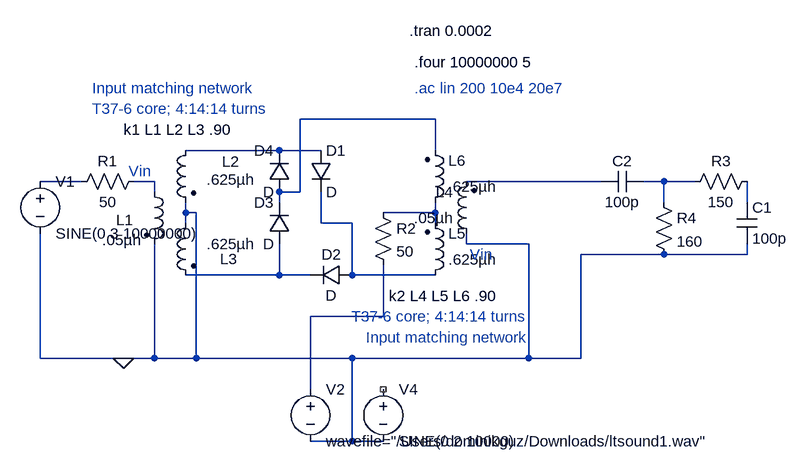
[diagram p0: schematic BalancedMixer.asc]
BalancedMixer.asc, the LTspice schematic file:
Version 4
SHEET 1 1704 764
WIRE 1056 144 848 144
WIRE 816 192 672 192
WIRE 880 192 816 192
WIRE 1056 192 1056 144
WIRE 512 240 448 240
WIRE 624 240 592 240
WIRE 1312 240 1104 240
WIRE 1408 240 1376 240
WIRE 1456 240 1408 240
WIRE 624 256 624 240
WIRE 848 256 848 144
WIRE 848 256 816 256
WIRE 816 272 816 256
WIRE 1408 272 1408 240
WIRE 1536 272 1536 240
WIRE 672 288 672 272
WIRE 688 288 672 288
WIRE 1056 288 1056 272
WIRE 1056 288 976 288
WIRE 672 304 672 288
WIRE 880 304 880 256
WIRE 928 304 880 304
WIRE 1056 304 1056 288
WIRE 1104 336 1104 320
WIRE 1200 336 1104 336
WIRE 1408 352 1280 352
WIRE 1536 352 1536 336
WIRE 1536 352 1408 352
WIRE 816 384 816 336
WIRE 816 384 672 384
WIRE 864 384 816 384
WIRE 928 384 928 304
WIRE 1056 384 928 384
WIRE 976 448 976 368
WIRE 976 448 864 448
WIRE 448 512 448 320
WIRE 576 512 448 512
WIRE 624 512 624 336
WIRE 624 512 576 512
WIRE 688 512 688 288
WIRE 688 512 624 512
WIRE 928 512 688 512
WIRE 1200 512 1200 336
WIRE 1200 512 928 512
WIRE 1280 512 1280 352
WIRE 1280 512 1200 512
WIRE 864 560 864 448
WIRE 928 640 928 512
WIRE 928 640 864 640
WIRE 976 640 928 640
FLAG 576 512 0
SYMBOL ind2 608 240 R0
WINDOW 0 -43 59 Left 2
WINDOW 3 -65 90 Left 2
SYMATTR InstName L1
SYMATTR Value .05µh
SYMATTR Type ind
SYMBOL ind2 688 176 M0
WINDOW 0 -67 33 Left 2
WINDOW 3 -90 61 Left 2
SYMATTR InstName L2
SYMATTR Value .625µh
SYMATTR Type ind
SYMBOL ind2 688 288 M0
WINDOW 0 -64 71 Left 2
WINDOW 3 -90 48 Left 2
SYMATTR InstName L3
SYMATTR Value .625µh
SYMATTR Type ind
SYMBOL ind2 1120 336 R180
WINDOW 0 36 80 Left 2
WINDOW 3 36 40 Left 2
SYMATTR InstName L4
SYMATTR Value .05µh
SYMATTR Type ind
SYMBOL ind2 1040 400 M180
WINDOW 0 36 80 Left 2
WINDOW 3 36 40 Left 2
SYMATTR InstName L5
SYMATTR Value .625µh
SYMATTR Type ind
SYMBOL ind2 1040 288 M180
WINDOW 0 36 80 Left 2
WINDOW 3 36 40 Left 2
SYMATTR InstName L6
SYMATTR Value .625µh
SYMATTR Type ind
SYMBOL diode 864 192 R0
SYMATTR InstName D1
SYMBOL diode 928 368 R90
WINDOW 0 0 32 VBottom 2
WINDOW 3 32 32 VTop 2
SYMATTR InstName D2
SYMBOL diode 832 336 R180
WINDOW 0 24 64 Left 2
WINDOW 3 24 0 Left 2
SYMATTR InstName D3
SYMBOL diode 832 256 R180
WINDOW 0 24 64 Left 2
WINDOW 3 24 0 Left 2
SYMATTR InstName D4
SYMBOL voltage 448 224 R0
SYMATTR InstName V1
SYMATTR Value SINE(0 3 10000000)
SYMBOL voltage 976 544 R0
SYMATTR InstName V4
SYMATTR Value SINE(0 2 10000)
SYMBOL res 608 224 R90
WINDOW 0 0 56 VBottom 2
WINDOW 3 32 56 VTop 2
SYMATTR InstName R1
SYMATTR Value 50
SYMBOL res 960 272 R0
SYMATTR InstName R2
SYMATTR Value 50
SYMBOL voltage 864 544 R0
SYMATTR InstName V2
SYMATTR Value wavefile="/Users/dominikguz/Downloads/ltsound1.wav"
SYMBOL res 1552 224 R90
WINDOW 0 0 56 VBottom 2
WINDOW 3 32 56 VTop 2
SYMATTR InstName R3
SYMATTR Value 150
SYMBOL cap 1520 272 R0
SYMATTR InstName C1
SYMATTR Value 100p
SYMBOL cap 1376 224 R90
WINDOW 0 0 32 VBottom 2
WINDOW 3 32 32 VTop 2
SYMATTR InstName C2
SYMATTR Value 100p
SYMBOL res 1392 256 R0
SYMATTR InstName R4
SYMATTR Value 160
TEXT 576 160 Left 2 !k1 L1 L2 L3 .90
TEXT 528 96 Left 2 ;Input matching network
TEXT 584 224 Left 2 ;Vin
TEXT 528 128 Left 2 ;T37-6 core; 4:14:14 turns
TEXT 1152 416 Right 2 !k2 L4 L5 L6 .90
TEXT 1200 480 Right 2 ;Input matching network
TEXT 1144 352 Right 2 ;Vin
TEXT 1200 448 Right 2 ;T37-6 core; 4:14:14 turns
TEXT 1016 8 Left 2 !.tran 0.0002
TEXT 1024 56 Left 2 !.four 10000000 5
TEXT 1024 96 Left 2 ;.ac lin 200 10e4 20e7

The netlist it stands for:
* BalancedMixer.asc
L1 N004 0 .05µh
L2 N002 0 .625µh
L3 0 N010 .625µh
L4 0 N005 .05µh
L5 N009 N008 .625µh
L6 N008 N001 .625µh
D1 N002 N009 D
D2 N009 N010 D
D3 N010 N001 D
D4 N001 N002 D
V1 N003 0 SINE(0 3 10000000)
V4 NC_01 0 SINE(0 2 10000)
R1 N004 N003 50
R2 N008 N011 50
V2 N011 0 wavefile="/Users/dominikguz/Downloads/ltsound1.wav"
R3 N007 N006 150
C1 N007 0 100p
C2 N006 N005 100p
R4 N006 0 160
.model D D
.lib standard.dio
k1 L1 L2 L3 .90
* Input matching network
* Vin
* T37-6 core; 4:14:14 turns
k2 L4 L5 L6 .90
* Input matching network
* Vin
* T37-6 core; 4:14:14 turns
.tran 0.0002
.four 10000000 5
* .ac lin 200 10e4 20e7
.backanno
.end